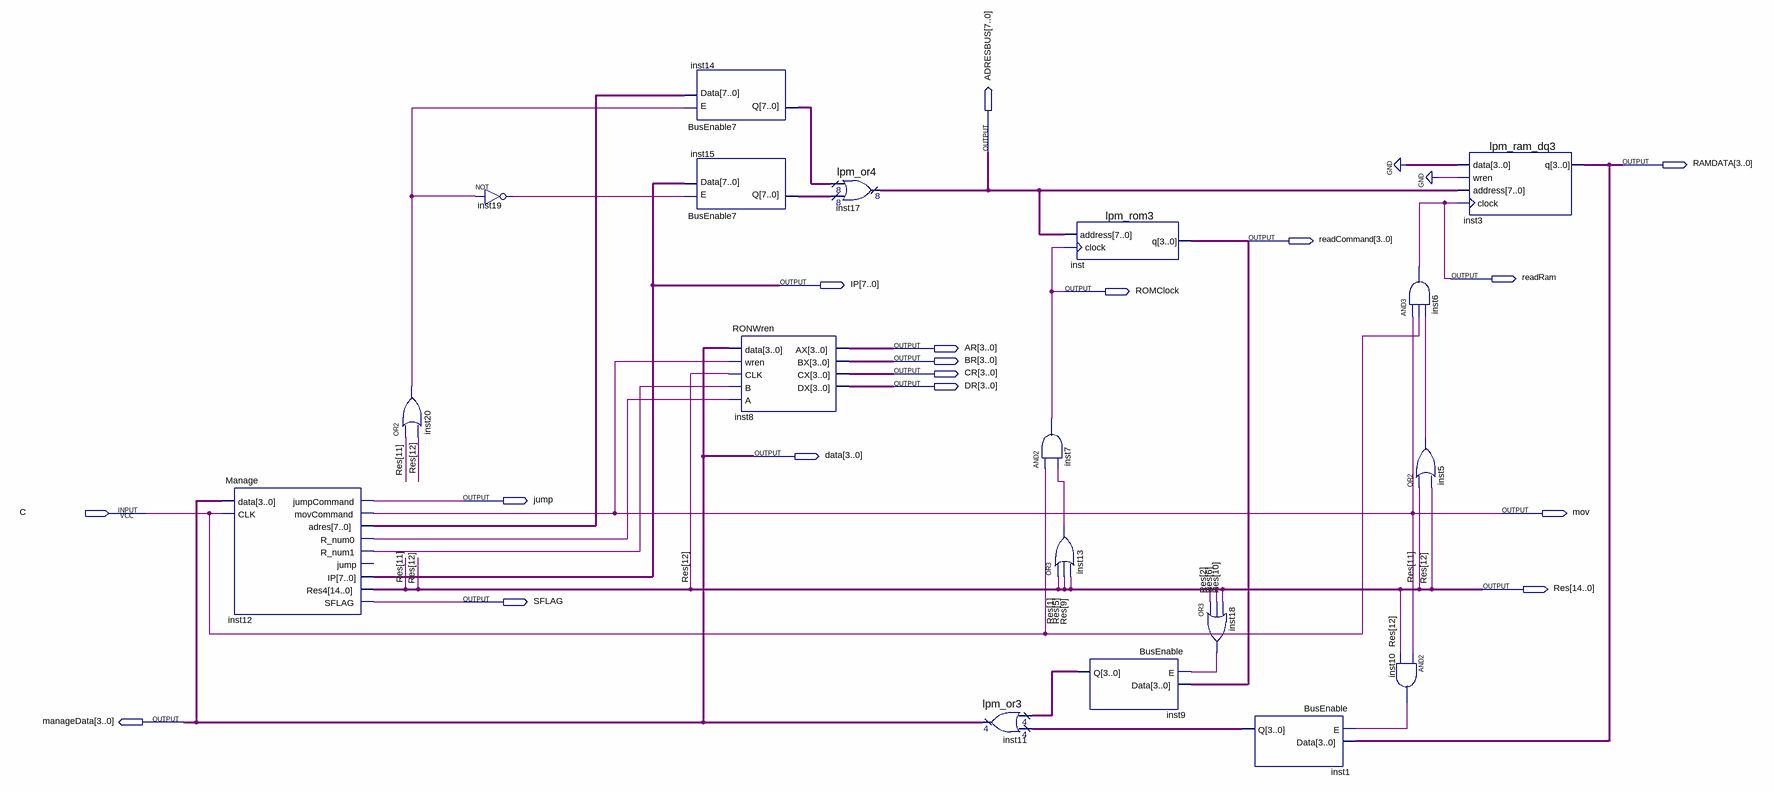
[diagram p0: schematic sheet]
// Quartus schematic SIFL4.bdf as structural Verilog: 18 symbols, 17 pins
module SIFL4 (
  input  C,
  output [7:0] ADRESBUS,
  output [3:0] RAMDATA,
  output [3:0] readCommand,
  output readRam,
  output [7:0] IP,
  output ROMClock,
  output [3:0] AR,
  output [3:0] BR,
  output [3:0] CR,
  output [3:0] DR,
  output [3:0] data,
  output jump,
  output mov,
  output [14:0] Res,
  output SFLAG,
  output [3:0] manageData
);

  wire inst5_out, inst10_out, inst12_r_num0, inst12_r_num1, inst13_out, inst18_out, inst19_out, inst20_out;
  wire [3:0] inst1_q, inst9_q;
  wire [7:0] inst12_adres, inst14_q, inst15_q;

  Manage inst12 (
    .data(data), .CLK(C), .jumpCommand(jump), .movCommand(mov), .adres(inst12_adres), .R_num0(inst12_r_num0),
    .R_num1(inst12_r_num1), .IP(IP), .Res4(Res), .SFLAG(SFLAG));  // open: jump
  or inst20 (inst20_out, Res[11], Res[12]);
  not inst19 (inst19_out, inst20_out);
  BusEnable7 inst14 (.E(inst20_out), .Data(inst12_adres), .Q(inst14_q));
  BusEnable7 inst15 (.E(inst19_out), .Data(IP), .Q(inst15_q));
  RONWren inst8 (
    .data(data), .wren(mov), .CLK(Res[12]), .B(inst12_r_num1), .A(inst12_r_num0), .AX(AR), .BX(BR), .CX(CR),
    .DX(DR));
  lpm_or4 inst17 (.data0x(inst14_q), .data1x(inst15_q), .result(ADRESBUS));
  lpm_or3 inst11 (.data0x(inst9_q), .data1x(inst1_q), .result(data));
  and inst7 (ROMClock, C, inst13_out);
  or inst13 (inst13_out, Res[1], Res[5], Res[9]);
  lpm_rom3 inst (.address(ADRESBUS), .clock(ROMClock), .q(readCommand));
  BusEnable inst9 (.E(inst18_out), .Data(readCommand), .Q(inst9_q));
  or inst18 (inst18_out, Res[2], Res[6], Res[10]);
  BusEnable inst1 (.E(inst10_out), .Data(RAMDATA), .Q(inst1_q));
  and inst6 (readRam, mov, C, inst5_out);
  or inst5 (inst5_out, Res[11], Res[12]);
  and inst10 (inst10_out, mov, Res[12]);
  lpm_ram_dq3 inst3 (.data(4'b0000), .wren(1'b0), .address(ADRESBUS), .clock(readRam), .q(RAMDATA));

  assign manageData = data;
endmodule
